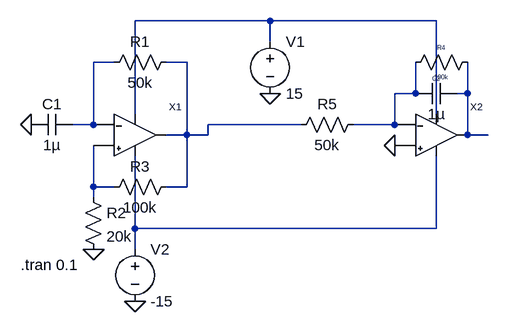
[diagram p0: schematic waveform generator.asc]
waveform generator.asc, the LTspice schematic file:
Version 4.1
SHEET 1 880 680
WIRE 352 -32 144 -32
WIRE 608 -32 352 -32
WIRE 352 0 352 -32
WIRE 112 32 80 32
WIRE 224 32 192 32
WIRE 576 80 576 32
WIRE 576 80 544 80
WIRE 656 80 656 32
WIRE 656 80 640 80
WIRE 144 112 144 -32
WIRE 608 112 608 -32
WIRE 80 128 80 32
WIRE 80 128 48 128
WIRE 400 128 256 128
WIRE 544 128 544 80
WIRE 544 128 480 128
WIRE 224 144 224 32
WIRE 224 144 192 144
WIRE 256 144 256 128
WIRE 256 144 224 144
WIRE 656 144 656 80
WIRE 688 144 656 144
WIRE 80 224 80 160
WIRE 112 224 80 224
WIRE 224 224 224 144
WIRE 224 224 192 224
WIRE 80 240 80 224
WIRE 144 288 144 176
WIRE 608 288 608 176
WIRE 608 288 144 288
WIRE 144 320 144 288
FLAG -16 128 0
FLAG 80 320 0
FLAG 352 80 0
FLAG 144 400 0
FLAG 544 160 0
SYMBOL LM741 144 144 R0
SYMATTR InstName X1
SYMBOL cap 48 112 R90
WINDOW 0 0 32 VBottom 2
WINDOW 3 32 32 VTop 2
SYMATTR InstName C1
SYMATTR Value 1µ
SYMBOL res 208 16 R90
WINDOW 0 0 56 VBottom 2
WINDOW 3 32 56 VTop 2
SYMATTR InstName R1
SYMATTR Value 50k
SYMBOL res 64 224 R0
SYMATTR InstName R2
SYMATTR Value 20k
SYMBOL res 208 208 R90
WINDOW 0 0 56 VBottom 2
WINDOW 3 32 56 VTop 2
SYMATTR InstName R3
SYMATTR Value 100k
SYMBOL voltage 352 -16 R0
WINDOW 123 0 0 Left 0
WINDOW 39 0 0 Left 0
SYMATTR InstName V1
SYMATTR Value 15
SYMBOL voltage 144 304 R0
WINDOW 123 0 0 Left 0
WINDOW 39 0 0 Left 0
SYMATTR InstName V2
SYMATTR Value -15
SYMBOL LM741 608 144 R0
SYMATTR InstName X2
SYMBOL cap 640 64 R90
WINDOW 0 0 32 VBottom 0
WINDOW 3 32 32 VTop 2
SYMATTR InstName C2
SYMATTR Value 1µ
SYMBOL res 672 16 R90
WINDOW 0 0 56 VBottom 0
WINDOW 3 32 56 VTop 0
SYMATTR InstName R4
SYMATTR Value 100k
SYMBOL res 496 112 R90
WINDOW 0 0 56 VBottom 2
WINDOW 3 32 56 VTop 2
SYMATTR InstName R5
SYMATTR Value 50k
TEXT -32 344 Left 2 !.tran 0.1

The netlist it stands for:
* waveform generator.asc
X§X1 N002 N006 N007 N001 N003 LM741  ; pins 2 3 -vdd vdd 6
C1 N002 0 1µ
R1 N003 N002 50k
R2 N006 0 20k
R3 N003 N006 100k
V1 N001 0 15
V2 N007 0 -15
X§X2 N004 0 N007 N001 N005 LM741  ; pins 2 3 -vdd vdd 6
C2 N005 N004 1µ
R4 N005 N004 100k
R5 N004 N003 50k
.tran 0.1
.backanno
.end